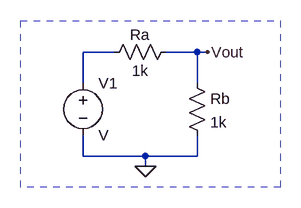
[diagram p0: schematic Circuit 1.asc]
Circuit 1.asc, the LTspice schematic file:
Version 4
SHEET 1 880 680
WIRE 144 48 96 48
WIRE 272 48 224 48
WIRE 288 48 272 48
WIRE 96 96 96 48
WIRE 272 96 272 48
WIRE 96 208 96 176
WIRE 192 208 96 208
WIRE 272 208 272 176
WIRE 272 208 192 208
WIRE 192 224 192 208
FLAG 192 224 0
FLAG 288 48 Vout
SYMBOL res 128 64 R270
WINDOW 0 27 56 VTop 2
WINDOW 3 3 56 VBottom 2
SYMATTR InstName Ra
SYMATTR Value 1k
SYMBOL voltage 96 80 R0
SYMATTR InstName V1
SYMBOL res 256 80 R0
SYMATTR InstName Rb
SYMATTR Value 1k
RECTANGLE Normal 400 256 0 0 2

The netlist it stands for:
* Circuit 1.asc
Ra N001 Vout 1k
V1 N001 0 V
Rb Vout 0 1k
.backanno
.end